# Altium schematic sheet Telephone Emulator.SchDoc
size A4
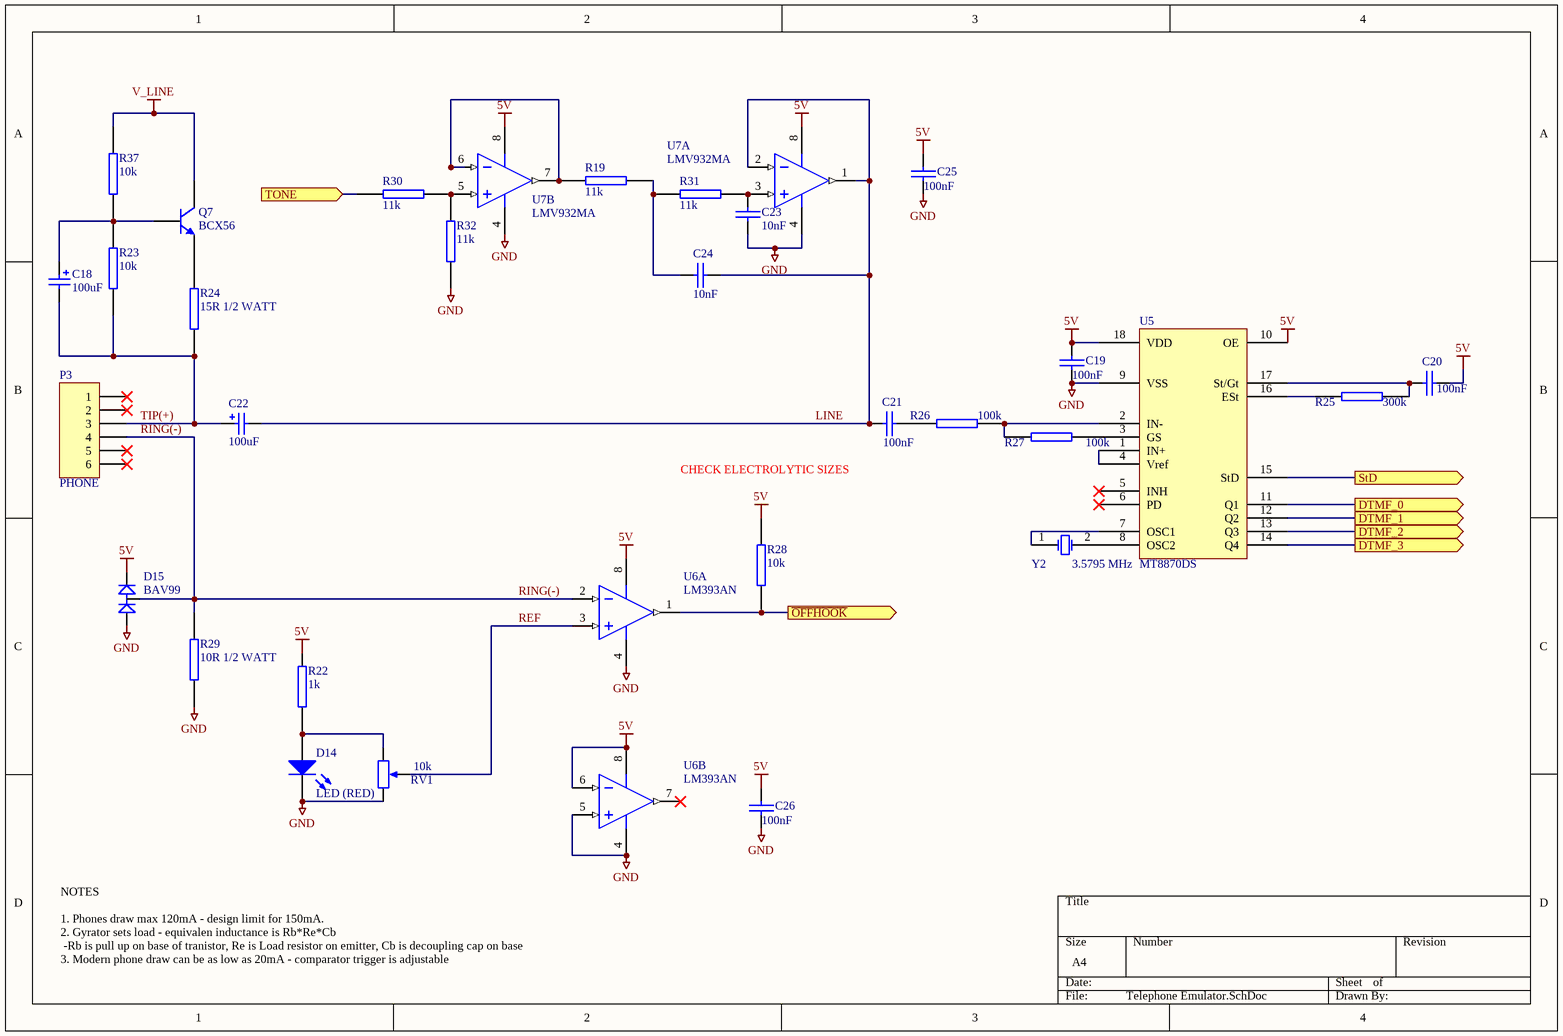
[diagram p0: Telephone Emulator.SchDoc]

## Parts
C18  100uF  [CAP ELECTRO SIZE-E]
C19  100nF  [CAP (3D) - 0603]
C20  100nF  [CAP (3D) - 0603]
C21  100nF  [CAP (3D) - 0603]
C22  100uF  [CAP ELECTRO SIZE-E]
C23  10nF  [CAP (3D) - 0603]
C24  10nF  [CAP (3D) - 0603]
C25  100nF  [CAP (3D) - 0603]
C26  100nF  [CAP (3D) - 0603]
D14  LED (RED)  [LED(3D) RED - 0805]
D15  BAV99  [SOT23-3L]
P3  PHONE  [MOLEXZ RJ11]
Q7  BCX56  [SOT89]
R19  11k  [RES (3D) - 0603]
R22  1k  [RES (3D) - 0603]
R23  10k  [RES (3D) - 0603]
R24  15R 1/2 WATT  [RES (3D) - 1210]
R25  300k  [RES (3D) - 0603]
R26  100k  [RES (3D) - 0603]
R27  100k  [RES (3D) - 0603]
R28  10k  [RES (3D) - 0603]
R29  10R 1/2 WATT  [RES (3D) - 1210]
R30  11k  [RES (3D) - 0603]
R31  11k  [RES (3D) - 0603]
R32  11k  [RES (3D) - 0603]
R37  10k  [RES (3D) - 0603]
RV1  10k  [TRIMPOT - PVZ3A]
U5  MT8870DS  [SOIC-18]
U6  LM393AN  [SO-8]  (parts A,B of 2)
U7  LMV932MA  [SO-8]  (parts A,B of 2)
Y2  3.5795 MHz  [HC49/4H_SMX]

## Ports
DTMF_0 (out), DTMF_1 (out), DTMF_2 (out), DTMF_3 (out), StD (out), TONE (in), ~{OFFHOOK} (out)

## Nets
5V: C19.1 C20.1 C25.1 C26.1 D15.2(C2) R28.2 U5.10(OE) U5.18(VDD) U6.6(IN-) U6.8(V+) U7.8(V+)
GND: C19.2 C23.2 C25.2 C26.2 D14.2(K) D15.1(A1) R29.1 R32.1 RV1.3 U5.9(VSS) U6.4(GND) U6.5(IN+) U7.4(GND)
V_LINE: Q7.2(C) R37.2
DTMF_0: U5.11(Q1) ; port DTMF_0
DTMF_1: U5.12(Q2) ; port DTMF_1
DTMF_2: U5.13(Q3) ; port DTMF_2
DTMF_3: U5.14(Q4) ; port DTMF_3
LINE: C21.2 C22.2 C24.2 U7.1(OUTA) U7.2(INA-)
~{OFFHOOK}: R28.1 U6.1(OUT) ; port ~{OFFHOOK}
REF: RV1.2 U6.3(IN+)
RING(-): D15.3(C1/A2) P3.4 R29.2 U6.2(IN-)
StD: U5.15(StD) ; port StD
TIP(+): C18.2 C22.1 P3.3 R23.1 R24.1
TONE: R30.1 ; port TONE
NetC18_1: C18.1 Q7.3(B) R23.2 R37.1
NetC20_2: C20.2 R25.2 U5.17(St/Gt)
NetC21_1: C21.1 R26.1
NetC23_1: C23.1 R31.2 U7.3(INA+)
NetC24_1: C24.1 R19.2 R31.1
NetD14_1: D14.1(A) R22.1 RV1.1
NetQ7_1: Q7.1(E) R24.2
NetR19_1: R19.1 U7.6(INB-) U7.7(OUTB)
NetR25_1: R25.1 U5.16(ESt)
NetR26_2: R26.2 R27.1 U5.2(IN-)
NetR27_2: R27.2 U5.3(GS)
NetR30_2: R30.2 R32.2 U7.5(INB+)
NetU5_1: U5.1(IN+) U5.4(Vref)
NetU5_7: U5.7(OSC1) Y2.1(OSC1)
NetU5_8: U5.8(OSC2) Y2.2(OSC2)

Not connected (* = marked no-connect by the designer): P3 1* 2* 5* 6*; R22 2; U5 5(INH)* 6(PD)*; U6 7(OUT)*

## Notes on the sheet
- CHECK ELECTROLYTIC SIZES
- NOTES
  1. Phones draw max 120mA - design limit for 150mA.
  2. Gyrator sets load - equivalen inductance is Rb*Re*Cb
  -Rb is pull up on base of tranistor, Re is Load resistor on emitter, Cb is decoupling cap on base
  3. Modern phone draw can be as low as 20mA - comparator trigger is adjustable
- Labels drawn without touching a wire or pin: 5V

## Library data of the parts
C18 C22 = 100uF 25V ALU E: 100uF 25V; Manufacturer: Cornell Dubilier; Manufacturer Part No.: AVE107M25E16T-F; Mouser Part no.: 598-AVE107M25E16T-F; Web link: http://au.mouser.com/ProductDetail/Cornell-Dubilier/AVE107M25E16T-F/?qs=%2fha2pyFaduhQkIFxhTUYGHjqKtvzDu12YwE1LyhVKKrxkq5U81i5PA%3d%3d; value: 100uF
C19-C21 C25 C26 = CAP: CAPACITOR SMD 0402; TAYDA SKU: A-4008; Value: 100nF
C23 C24 = CAP SMD 0603 100nF: CAPACITOR SMD 0603; value: 10nF
D14 = LED 0805 RED
D15 = BAV99: DUAL DIODE, BAV99; Manufacturer: FAIRCHILD SEMICONDUCTOR; Mouser Part no.: 771-BAV99/T3; Farnell Part no.: 9843612; Manufacturer Part No.: BAV99; PackageReference: SOT-23; value: BAV99; Web link: http://au.mouser.com/ProductDetail/NXP-Semiconductors/BAV99-T3/?qs=sGAEpiMZZMtldOIVIVqa3WNg7zlWz8nBhXHsMX6ttIg%3d
P3 = Header 6: Header, 6-Pin; Value: RJ12; Mouser Part No.: 43860-0020
Q7 = BCX56: NPN Bipolar Transistor; Manufacturer: NXP Semiconductors; Manufacturer Part No.: BCX56-16,135; Mouser Part no.: 771-BCX56-16135; value: BCX56
R19 R30-R32 = RES SMD 0603 1k: RESISTOR SMD 0603 1k; Substitute Allowed: Yes; value: 11k
R22 = RES SMD 0603 1k: RESISTOR SMD 0603 1k; Manufacturer: Bourns; Manufacturer Part No.: CR0603-JW-102ELF; Substitute Allowed: Yes; Mouser Part no.: 652-CR0603-JW-102ELF; Web link: http://au.mouser.com/ProductDetail/Bourns/CR0603-JW-102ELF/?qs=sGAEpiMZZMu61qfTUdNhG2nPoCjtvs%252bRXTOJv8O9Kbk%3d; value: 1k
R23 R37 = RES SMD 0603 10k: RESISTOR SMD 0603 10k; Manufacturer: Bourns; Manufacturer Part No.: CR0603FX-1002ELF; Mouser Part no.: 652-CR0603FX-1002ELF; Web link: http://au.mouser.com/Search/Refine.aspx?Keyword=652-CR0603FX-1002ELF; value: 10k
R24 R29 = RES SMD 0603 100R: RESISTOR SMD 0603
  R24: Value: 15R 1/2 WATT; Mouser Part No.: ERJ-14NF15R0U
  R29: Value: 10R 1/2 WATT; Mouser Part No.: ERJ-14NF10R0U
R25 = RES SMD 0603 100R: RESISTOR SMD 0603; TAYDA SKU: A-2081; Value: 300k
R26 R27 = RES SMD 0603 100R: RESISTOR SMD 0603; TAYDA SKU: A-2248; Value: 100k
R28 = RES SMD 0603 100R: RESISTOR SMD 0603; TAYDA SKU: A-2203; Value: 10k
RV1 = VAR (POT) SMD: Variable Resistor; Series: PVZ3A; Value: 10k
U5 = MT8870: MT8870 DTMF DECODER; Value: MT8870DS; Futurelec Part No.: MT8870DS
U6 = LM393AN: Dual Comparator; TAYDA SKU: A-023; Value: LM393AN
U7 = LMV932MA/NOPB: Low Power Dual Operational Amplifier, 8-pin Narrow SOIC; Value: LMV932MA
Y2 = XTAL: Crystal Oscillator; Value: 3.5795 MHz